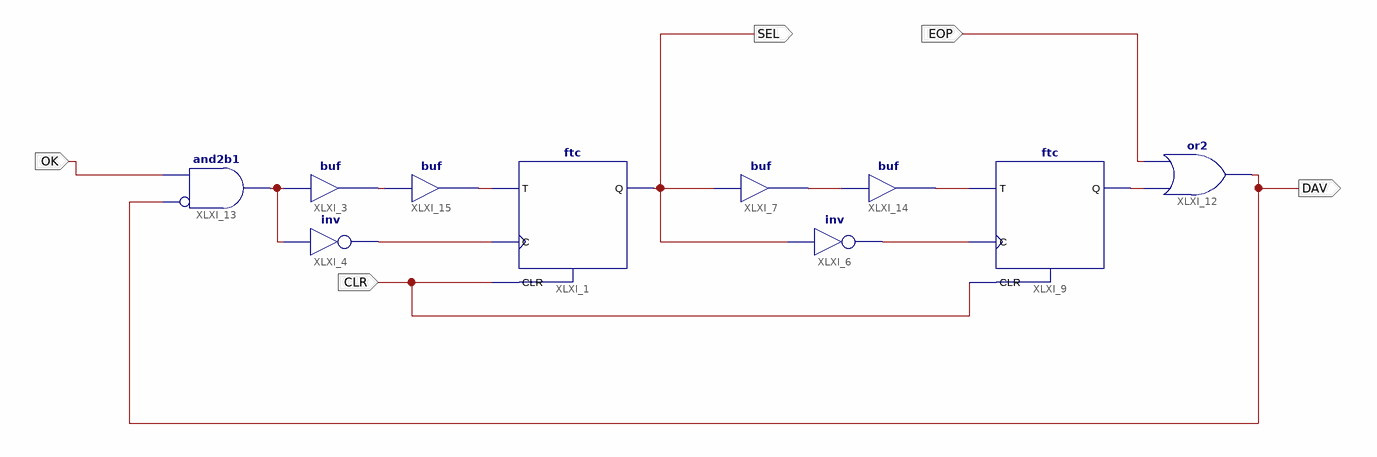
[diagram p0: schematic sheet 1]
// Xilinx ISE schematic Selector_module.sch (xbr) as structural Verilog: 10 symbols, 5 ports
module Selector_module (
  input  CLR,
  input  OK,
  input  EOP,
  output SEL,
  output DAV
);

  wire XLXN_5, XLXN_11, XLXN_23, XLXN_35, XLXN_41, XLXN_42, XLXN_43, XLXN_45;

  ftc XLXI_1 (.C(XLXN_5), .CLR(CLR), .T(XLXN_45), .Q(SEL));
  not XLXI_4 (XLXN_5, XLXN_23);
  not XLXI_6 (XLXN_11, SEL);
  buf XLXI_7 (XLXN_42, SEL);
  ftc XLXI_9 (.C(XLXN_11), .CLR(CLR), .T(XLXN_43), .Q(XLXN_35));
  buf XLXI_3 (XLXN_41, XLXN_23);
  or XLXI_12 (DAV, XLXN_35, EOP);
  and XLXI_13 (XLXN_23, ~DAV, OK);  // and2b1
  buf XLXI_14 (XLXN_43, XLXN_42);
  buf XLXI_15 (XLXN_45, XLXN_41);
endmodule
